# EAGLE schematic mag comp (EAGLE 9.2.0)
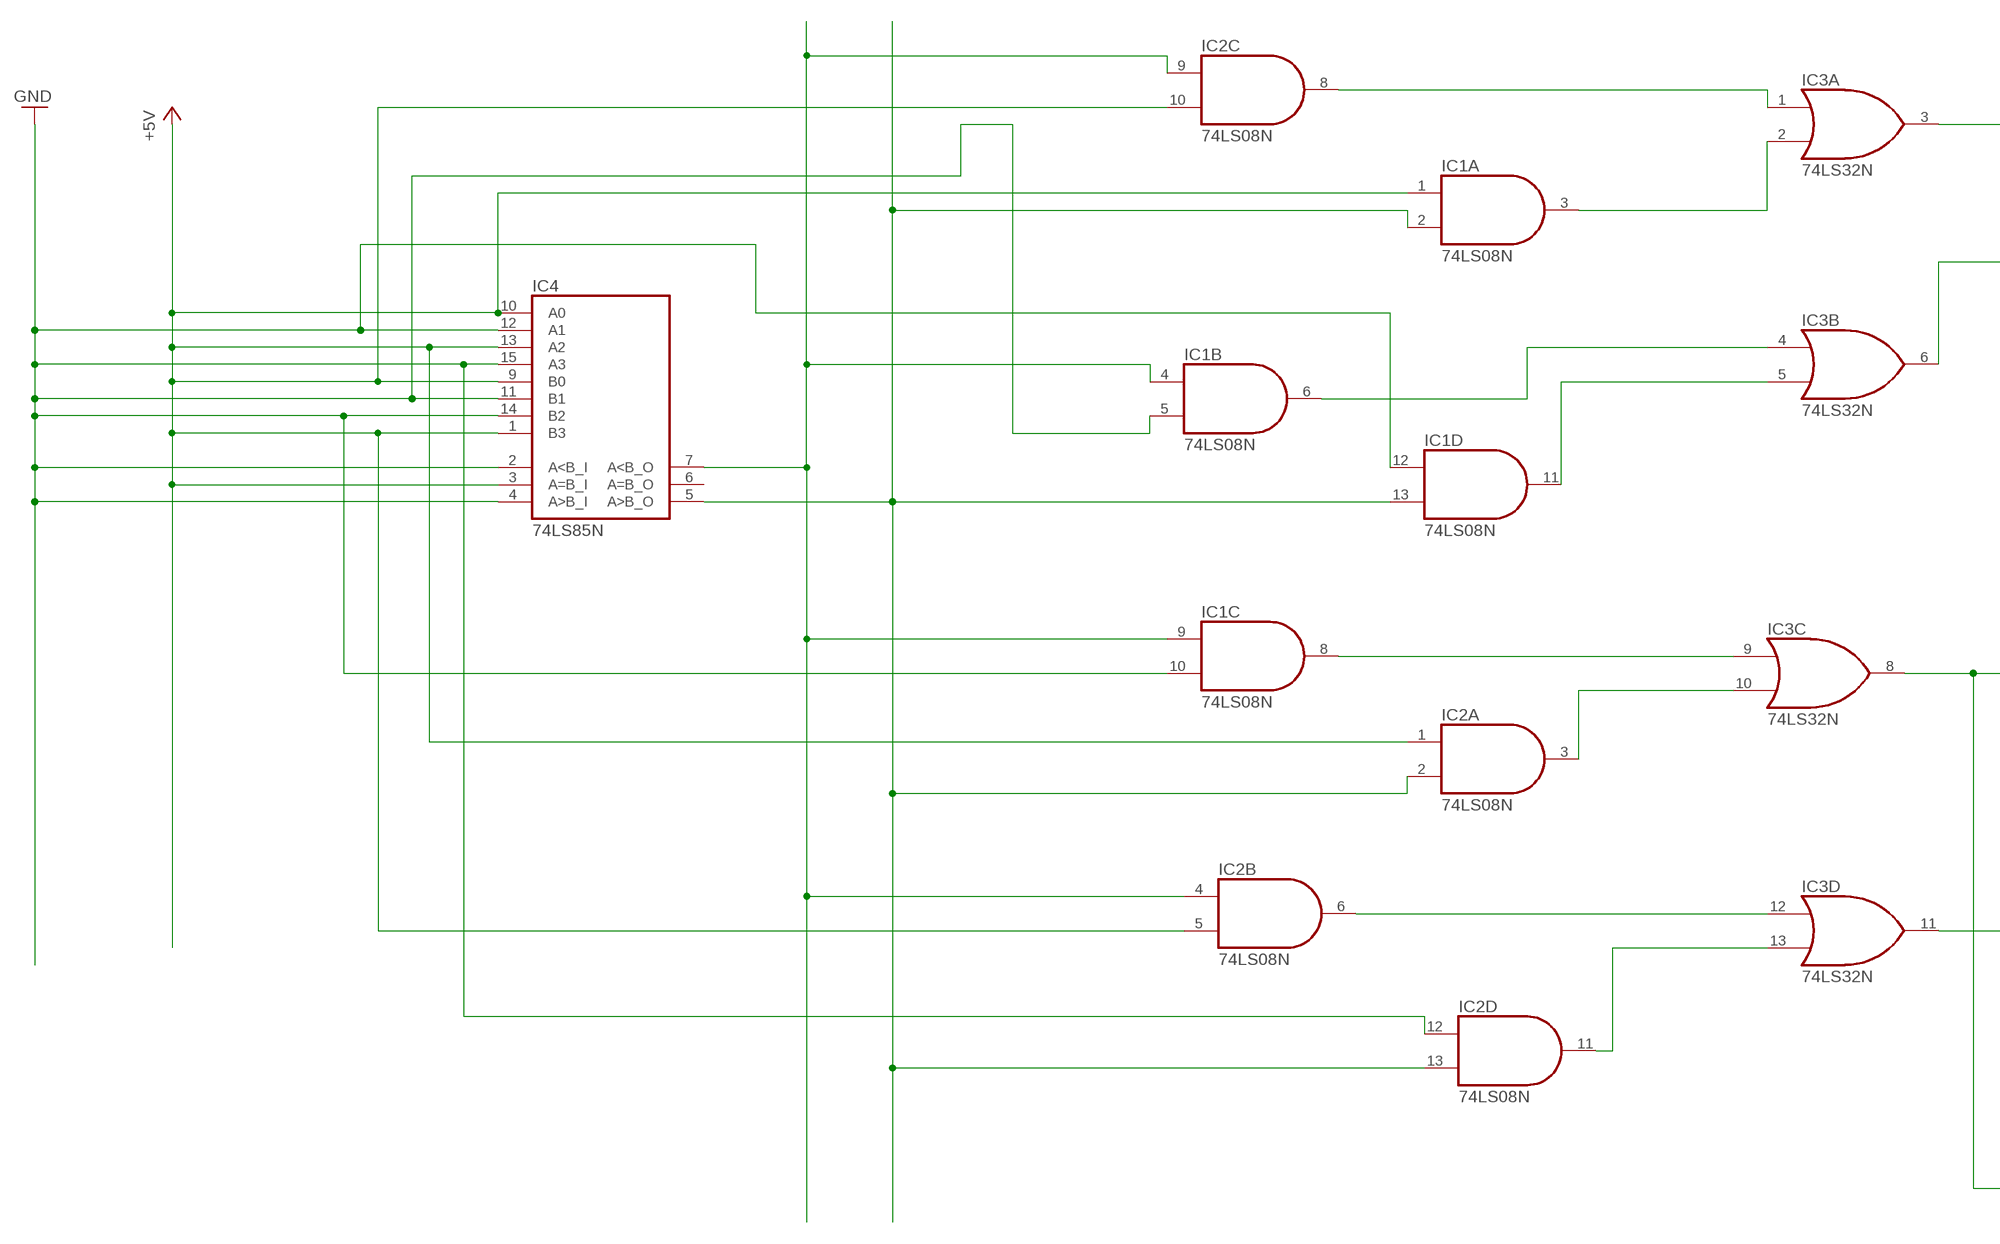
[diagram p0: schematic, sheet 1, part 1 of 2]
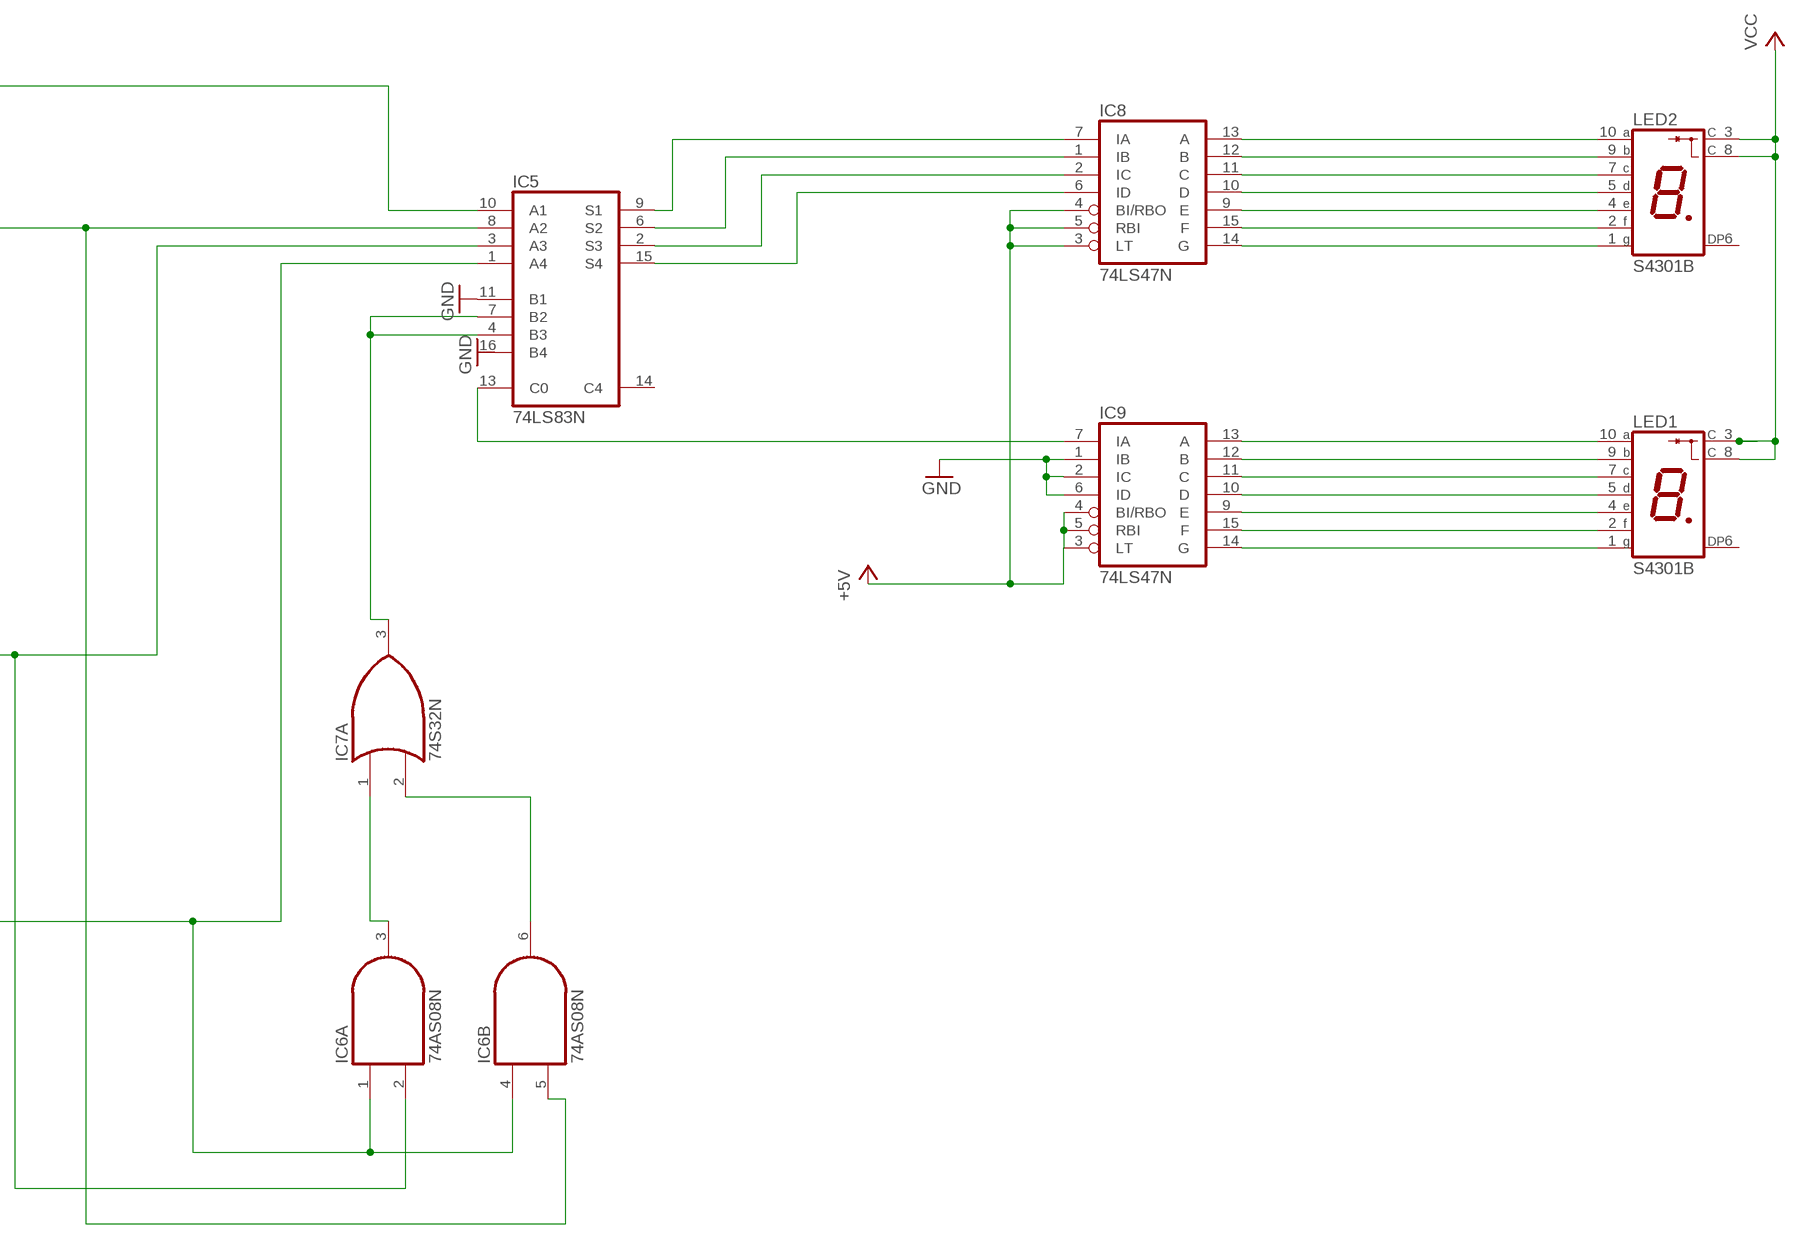
[diagram p1: schematic, sheet 1, part 2 of 2]

## Parts
IC1  74LS08N  [DIL14]
IC2  74LS08N  [DIL14]
IC3  74LS32N  [DIL14]
IC4  74LS85N  [DIL16]
IC5  74LS83N  [DIL16]
IC6  74AS08N  [DIL14]
IC7  74S32N  [DIL14]
IC8  74LS47N  [DIL16]
IC9  74LS47N  [DIL16]
LED1  S4301B  [S4301B]
LED2  S4301B  [S4301B]

## Nets
+5V: IC1.1(A:I0) IC2.1(A:I0) IC2.5(B:I1) IC2.10(C:I1) IC4.1(B3) IC4.3(A=B_I) IC4.9(B0) IC4.10(A0) IC4.13(A2) IC8.3(LT) IC8.4(BI/RBO) IC8.5(RBI) IC9.3(LT) IC9.4(BI/RBO) IC9.5(RBI)
GND: IC1.5(B:I1) IC1.10(C:I1) IC1.12(D:I0) IC2.12(D:I0) IC4.2(A<B_I) IC4.4(A>B_I) IC4.11(B1) IC4.12(A1) IC4.14(B2) IC4.15(A3) IC5.11(B1) IC9.1(IB) IC9.2(IC) IC9.6(ID)
N$1: IC1.4(B:I0) IC1.9(C:I0) IC2.4(B:I0) IC2.9(C:I0) IC4.7(A<B_O)
N$2: IC1.2(A:I1) IC1.13(D:I1) IC2.2(A:I1) IC2.13(D:I1) IC4.5(A>B_O)
N$11: IC1.6(B:O) IC3.4(B:I0)
N$12: IC1.11(D:O) IC3.5(B:I1)
N$13: IC1.8(C:O) IC3.9(C:I0)
N$14: IC2.3(A:O) IC3.10(C:I1)
N$15: IC2.6(B:O) IC3.12(D:I0)
N$16: IC2.11(D:O) IC3.13(D:I1)
N$17: IC2.8(C:O) IC3.1(A:I0)
N$18: IC1.3(A:O) IC3.2(A:I1)
N$19: IC3.3(A:O) IC5.10(A1)
N$20: IC3.6(B:O) IC5.8(A2) IC6.5(B:I1)
N$21: IC3.8(C:O) IC5.3(A3) IC6.2(A:I1)
N$22: IC3.11(D:O) IC5.1(A4) IC6.1(A:I0) IC6.4(B:I0)
N$23: IC6.3(A:O) IC7.1(A:I0)
N$24: IC6.6(B:O) IC7.2(A:I1)
N$25: IC5.4(B3) IC5.7(B2) IC7.3(A:O)
N$26: IC5.9(S1) IC8.7(IA)
N$27: IC5.6(S2) IC8.1(IB)
N$28: IC5.2(S3) IC8.2(IC)
N$29: IC5.15(S4) IC8.6(ID)
N$30: IC5.13(C0) IC9.7(IA)
N$31: IC8.13(A) LED2.10(A)
N$32: IC8.12(B) LED2.9(B)
N$33: IC8.11(C) LED2.7(C)
N$34: IC8.10(D) LED2.5(D)
N$35: IC8.9(E) LED2.4(E)
N$36: IC8.15(F) LED2.2(F)
N$37: IC8.14(G) LED2.1(G)
N$38: IC9.13(A) LED1.10(A)
N$39: IC9.12(B) LED1.9(B)
N$40: IC9.11(C) LED1.7(C)
N$41: IC9.10(D) LED1.5(D)
N$42: IC9.9(E) LED1.4(E)
N$43: IC9.15(F) LED1.2(F)
N$44: IC9.14(G) LED1.1(G)
VCC: LED1.3(C) LED1.8(C) LED2.3(C) LED2.8(C)
Unconnected: IC4.6(A=B_O) IC5.14(C4) IC5.16(B4) IC6.8(C:O) IC6.9(C:I0) IC6.10(C:I1) IC6.11(D:O) IC6.12(D:I0) IC6.13(D:I1) IC7.4(B:I0) IC7.5(B:I1) IC7.6(B:O) IC7.8(C:O) IC7.9(C:I0) IC7.10(C:I1) IC7.11(D:O) IC7.12(D:I0) IC7.13(D:I1) LED1.6(DP) LED2.6(DP)

## Power pins joined to a net without a drawn wire
GND: IC1.7(P:GND) IC2.7(P:GND) IC3.7(P:GND) IC4.8(GND) IC5.12(GND) IC6.7(P:GND) IC7.7(P:GND) IC8.8(GND) IC9.8(GND)
VCC: IC1.14(P:VCC) IC2.14(P:VCC) IC3.14(P:VCC) IC4.16(VCC) IC5.5(VCC) IC6.14(P:VCC) IC7.14(P:VCC) IC8.16(VCC) IC9.16(VCC)

## Library data of the parts
IC1 IC2 IC6 = 74xx-us:74*08: Quad 2-input AND gate
IC3 IC7 = 74xx-us:74*32: Quad 2-input OR gate
IC4 = 74xx-us:74*85: 4-bit magnitude COMPARATOR
IC5 = 74xx-us:74*83: 4-bit binary full ADDER, fast carry
IC8 IC9 = 74xx-eu:74*47: BCD to seven segment DECODER/DRIVER Source: http://www.ee.washington.edu/stores/DataSheets/74ls/74ls47.pdf
LED1 LED2 = led-7-segment:S4301B: Single Digit Seven-Segment Display (cathode common) Source: LITEON .. S4301B.pdf; OC_FARNELL: unknown; OC_NEWARK: unknown